# Altium schematic sheet [03] - CONNECTORS.SchDoc
size A4
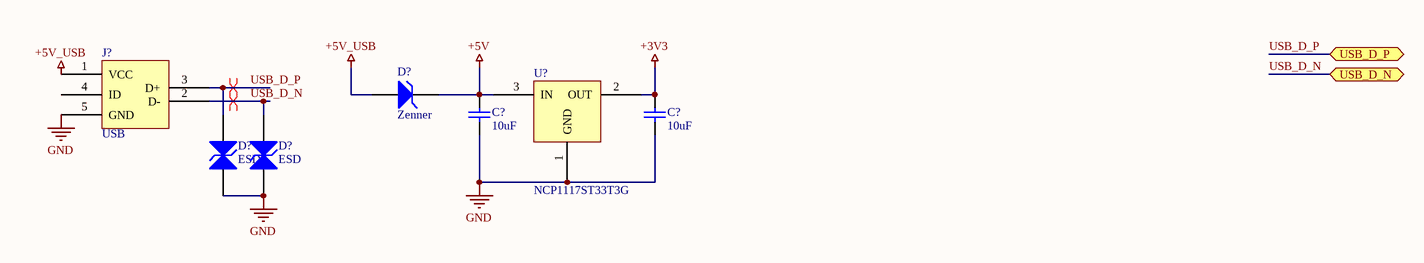
[diagram p0: [03] - CONNECTORS.SchDoc]

## Parts
(Parts that share a designator on the sheet are numbered #1, #2 ... from top to bottom, then left to right.)
C?#1  10uF
C?#2  10uF
D?#1  Zenner
D?#2  ESD
D?#3  ESD
J?  USB  [10118194-0001LF]
U?  NCP1117ST33T3G

## Ports
USB_D_N (bidir), USB_D_P (bidir)

## Nets
+3V3: C?#2.2 U?.2(OUT)
+5V: C?#1.2 D?#1.2(K) U?.3(IN)
+5V_USB: D?#1.1(A) J?.1(VCC)
GND: C?#1.1 C?#2.1 D?#2.1(A) D?#3.1(A) J?.5(GND) U?.1(GND)
USB_D_N: D?#3.2(K) J?.2(D-) ; port USB_D_N
USB_D_P: D?#2.2(K) J?.3(D+) ; port USB_D_P

Not connected (* = marked no-connect by the designer): J? 4(ID)

## Layout directives
differential pair; differential pair class USB_D_N: USB_D_N
differential pair; differential pair class USB_D_P: USB_D_P

## Library data of the parts
C?#1 C?#2 = CL21A106KPFNNNG: Cap Ceramic 10uF 10V X5R 10% SMD 0805 85C Embossed T/R; Manufacturer: Samsung; Supplier 1: Digi-Key; Manufacturer Part Number: CL21A106KPFNNNG; RoHS: Yes; Stock 1: 918320; Pricing 1: 1 = 0,14000, 10 = 0,10000, 100 = 0,04690, 500 = 0,03290, 1000 = 0,02724 (USD); Mount: Surface Mount; Case/Package: 0805; Case Code (Metric): 2012; Case Code (Imperial): 0805; Min Operating Temperature: -55°C; Max Operating Temperature: 85°C; Capacitance: 10uF; Tolerance: 10%; Dielectric: X5R; Voltage: 10V; Voltage Rating: 10V; Packaging: Tape and Reel; Package Quantity: 3000; Termination: Wraparound; Length: 2mm; Height: 1.25mm; Depth: 1.25mm; Width: 0.049inch; Thickness: 0.053inch; Radiation Hardening: No; Lead Free: Lead Free; ComponentLink1URL: https://datasheet.ciiva.com/16428/cl21a106kpfnnng-16428896.pdf?src-supplier=Future+Electronics; ComponentLink1Description: https://datasheet.ciiva.com/16428/cl21a106kpfnnng-16428896.pdf?src-supplier=Future+Electronics; ComponentLink2URL: https://datasheet.ciiva.com/26936/getdatasheetpartid-640497-26936900.pdf?src-supplier=Verical; ComponentLink2Description: https://datasheet.ciiva.com/26936/getdatasheetpartid-640497-26936900.pdf?src-supplier=Verical; Supplier Part Number 1: 1276-6456-1-ND
D?#1 = SS14: DIODE SCHOTTKY 40V 1A SMA; Manufacturer: ON Semiconductor / Fairchild; Forward Voltage: 500mV; Peak Non-Repetitive Surge Current: 40A; Element Configuration: Single; Peak Reverse Current: 200uA; Number of Elements: 1; Max Power Dissipation: 1.1W; Polarity: Standard; Supplier 1: Digi-Key; Manufacturer Part Number: SS14; RoHS: Yes; Stock 1: 183262; Pricing 1: 1 = 0,43000, 10 = 0,32500, 100 = 0,20270, 500 = 0,13872, 1000 = 0,10670 (USD); Mount: Surface Mount; Case/Package: SMA; Number of Pins: 2; Weight: 0.003739oz; Number of Terminals: 2; Min Operating Temperature: -65°C; Max Operating Temperature: 125°C; Packaging: Tape and Reel; Package Quantity: 7500; Forward Current: 1A; Max Repetitive Reverse Voltage (Vrrm): 40V; Max Forward Surge Current (Ifsm): 40A; Average Rectified Current: 1A; Termination: SMD/SMT; Power Dissipation: 1.1W; Voltage Rating (DC): 40V; Current Rating: 1A; Output Current: 1A; Current: 1A; Voltage: 40V; Max Reverse Voltage (DC): 40V; Length: 4.75mm; Height: 2.2mm; Width: 2.95mm; Radiation Hardening: No; REACH SVHC: No SVHC; Lead Free: Lead Free; ComponentLink1URL: https://datasheet.ciiva.com/34301/1089027-34301973.pdf?src-supplier=Jameco; ComponentLink1Description: https://datasheet.ciiva.com/34301/1089027-34301973.pdf?src-supplier=Jameco; ComponentLink2URL: https://datasheet.ciiva.com/4713/ss14-197224-4713938.pdf?src-supplier=Mouser; ComponentLink2Description: https://datasheet.ciiva.com/4713/ss14-197224-4713938.pdf?src-supplier=Mouser; ComponentLink3URL: https://datasheet.ciiva.com/16744/ss14-16744879.pdf?src-supplier=Future+Electronics; ComponentLink3Description: https://datasheet.ciiva.com/16744/ss14-16744879.pdf?src-supplier=Future+Electronics; ComponentLink4URL: https://datasheet.ciiva.com/8303/ss19-8303766.pdf?src-supplier=Avnet; ComponentLink4Description: https://datasheet.ciiva.com/8303/ss19-8303766.pdf?src-supplier=Avnet; ComponentLink5URL: https://datasheet.ciiva.com/910/ss12-910695.pdf?src-supplier=Digi-Key; ComponentLink5Description: https://datasheet.ciiva.com/910/ss12-910695.pdf?src-supplier=Digi-Key; ComponentLink6URL: https://datasheet.ciiva.com/7965/1766303-7965241.pdf?src-supplier=Element14; ComponentLink6Description: https://datasheet.ciiva.com/7965/1766303-7965241.pdf?src-supplier=Element14; ComponentLink7URL: https://datasheet.ciiva.com/910/ss12-910696.pdf?src-supplier=Digi-Key; ComponentLink7Description: https://datasheet.ciiva.com/910/ss12-910696.pdf?src-supplier=Digi-Key; ComponentLink8URL: https://datasheet.ciiva.com/25951/ss19-25951496.pdf?src-supplier=Avnet+Europe; ComponentLink8Description: https://datasheet.ciiva.com/25951/ss19-25951496.pdf?src-supplier=Avnet+Europe; ComponentLink9URL: https://datasheet.ciiva.com/910/ss12-910697.pdf?src-supplier=Digi-Key; ComponentLink9Description: https://datasheet.ciiva.com/910/ss12-910697.pdf?src-supplier=Digi-Key; ComponentLink10URL: https://datasheet.ciiva.com/22651/1880990-22651980.pdf?src-supplier=Element14; ComponentLink10Description: https://datasheet.ciiva.com/22651/1880990-22651980.pdf?src-supplier=Element14; Supplier Part Number 1: SS14CT-ND
D?#2 D?#3 = CPDQ5V0-HF: TVS DIODE 5V 18.6V 0402/SOD923F; Manufacturer: Comchip; Min Breakdown Voltage: 5.6V; Peak Pulse Power: 174W; Power Line Protection: No; Peak Pulse Current: 9.4A; Capacitance: 15pF; Number of Bidirectional Channels: 1; Supplier 1: Digi-Key; Manufacturer Part Number: CPDQ5V0-HF; RoHS: Yes; Stock 1: 208826; Pricing 1: 1 = 0,30000, 10 = 0,27600, 25 = 0,19840, 100 = 0,15440, 250 = 0,09704, 500 = 0,08268, 1000 = 0,05623, 2500 = 0,05072 (USD); Mount: Surface Mount; Case/Package: 0402; Min Operating Temperature: -40°C; Max Operating Temperature: 125°C; Packaging: Tape and Reel; Package Quantity: 8000; Reverse Standoff Voltage: 5V; Clamping Voltage: 18.6V; Breakdown Voltage: 5.6V; Composition: Zener; Operating Supply Voltage: 5V; ComponentLink1URL: https://datasheet.ciiva.com/6577/cpdq5v0-hf20reva825126-6577872.pdf?src-supplier=Digi-Key; ComponentLink1Description: https://datasheet.ciiva.com/6577/cpdq5v0-hf20reva825126-6577872.pdf?src-supplier=Digi-Key; ComponentLink2URL: https://datasheet.ciiva.com/12545/cpdq5v0-hf20reva825126-218795-12545530.pdf?src-supplier=Mouser; ComponentLink2Description: https://datasheet.ciiva.com/12545/cpdq5v0-hf20reva825126-218795-12545530.pdf?src-supplier=Mouser; Supplier Part Number 1: 641-1478-1-ND
J? = 10118194-0001LF: CONN RCPT USB2.0 MICRO B SMD R/A; Manufacturer: Amphenol FCI; Gender: Receptacle; Current Rating: 1.8A; Number of Contacts: 5; Insulation Resistance: 1GR; Number of Ports: 1; Max Voltage Rating (AC): 100V; Pitch: 0.65mm; Supplier 1: Digi-Key; Manufacturer Part Number: 10118194-0001LF; RoHS: Yes; Stock 1: 136800; Pricing 1: 1200 = 0,208430, 2400 = 0,190560, 6000 = 0,178650, 8400 = 0,166740, 12000 = 0,160790, 30000 = 0,158400, 60000 = 0,154830 (USD); Mount: Surface Mount; Color: Black; Contact Material: Copper Alloy; Contact Plating: Gold; Number of Terminals: 5; Housing Material: Polymer; Min Operating Temperature: -55°C; Max Operating Temperature: 85°C; Package Quantity: 9600; Packaging: Tape and Reel; Connector Type: USB; Termination: Solder; Orientation: Right Angle; Features: Shielded; Length: 8.05mm; Depth: 5mm; Radiation Hardening: No; Lead Free: Lead Free; Flammability Rating: UL94 V-0; ComponentLink1URL: https://datasheet.ciiva.com/4598/10118194ac-197217-4598807.pdf?src-supplier=Mouser; ComponentLink1Description: https://datasheet.ciiva.com/4598/10118194ac-197217-4598807.pdf?src-supplier=Mouser; ComponentLink2URL: https://datasheet.ciiva.com/29907/10118194-29907230.pdf?src-supplier=Avnet; ComponentLink2Description: https://datasheet.ciiva.com/29907/10118194-29907230.pdf?src-supplier=Avnet; ComponentLink3URL: https://datasheet.ciiva.com/26945/getdatasheetpartid-418619-26945695.pdf?src-supplier=Verical; ComponentLink3Description: https://datasheet.ciiva.com/26945/getdatasheetpartid-418619-26945695.pdf?src-supplier=Verical; ComponentLink4URL: https://datasheet.ciiva.com/851/10118194-851110.pdf?src-supplier=Digi-Key; ComponentLink4Description: https://datasheet.ciiva.com/851/10118194-851110.pdf?src-supplier=Digi-Key; ComponentLink5URL: https://datasheet.ciiva.com/851/10118194-851111.pdf?src-supplier=Digi-Key; ComponentLink5Description: https://datasheet.ciiva.com/851/10118194-851111.pdf?src-supplier=Digi-Key; Supplier Part Number 1: 609-4618-2-ND
U? = NCP1117ST33T3G: IC REG LINEAR 3.3V 1A SOT223; Manufacturer: ON Semiconductor; Max Input Voltage: 20V; Number of Outputs: 1; Dropout Voltage: 1.07V; Max Supply Voltage: 15V; Min Supply Voltage: 4.75V; Min Input Voltage: 3.5V; Input Bias Current: 6mA; Quiescent Current: 10mA; Polarity: Positive; Reference Voltage: 1.25V; Accuracy: 1%; Output Type: Fixed; Supplier 1: Digi-Key; Manufacturer Part Number: NCP1117ST33T3G; RoHS: Yes; Stock 1: 114545; Pricing 1: 1 = 0,52000, 10 = 0,44400, 100 = 0,33150, 500 = 0,26048, 1000 = 0,20129 (USD); Mount: Surface Mount; Case/Package: SOT-223; Number of Pins: 3; Contact Plating: Tin; Min Operating Temperature: 0°C; Max Operating Temperature: 125°C; Output Voltage: 3.3V; Packaging: Tape and Reel; Output Current: 1A; Max Output Current: 1A; Package Quantity: 1; Nominal Output Voltage: 3.3V; Number of Regulators: 1; Min Current Limit: 1A; Min Output Voltage: 3.3V; Max Output Voltage: 3.3V; Termination: SMD/SMT; Output Voltage Accuracy: 1%; Length: 6.7mm; Height: 1.69mm; Width: 3.7mm; Radiation Hardening: No; REACH SVHC: No SVHC; Lead Free: Lead Free; Halogen Free: Halogen Free; ComponentLink1URL: https://datasheet.ciiva.com/3224/ncp1117-d-3224144.pdf?src-supplier=Avnet; ComponentLink1Description: https://datasheet.ciiva.com/3224/ncp1117-d-3224144.pdf?src-supplier=Avnet; ComponentLink2URL: https://datasheet.ciiva.com/22697/1726422-22697602.pdf?src-supplier=Element14; ComponentLink2Description: https://datasheet.ciiva.com/22697/1726422-22697602.pdf?src-supplier=Element14; ComponentLink3URL: https://datasheet.ciiva.com/15111/getdatasheetpartid-82718-15111483.pdf?src-supplier=Verical; ComponentLink3Description: https://datasheet.ciiva.com/15111/getdatasheetpartid-82718-15111483.pdf?src-supplier=Verical; ComponentLink4URL: https://datasheet.ciiva.com/28483/1748260-28483307.pdf?src-supplier=Element14; ComponentLink4Description: https://datasheet.ciiva.com/28483/1748260-28483307.pdf?src-supplier=Element14; ComponentLink5URL: https://datasheet.ciiva.com/2042/ncp1117-d-2042028.pdf?src-supplier=Digi-Key; ComponentLink5Description: https://datasheet.ciiva.com/2042/ncp1117-d-2042028.pdf?src-supplier=Digi-Key; ComponentLink6URL: https://datasheet.ciiva.com/8233/ncp1117-d-8233589.pdf?src-supplier=Avnet; ComponentLink6Description: https://datasheet.ciiva.com/8233/ncp1117-d-8233589.pdf?src-supplier=Avnet; ComponentLink7URL: https://datasheet.ciiva.com/8073/1726422-8073735.pdf?src-supplier=Element14; ComponentLink7Description: https://datasheet.ciiva.com/8073/1726422-8073735.pdf?src-supplier=Element14; ComponentLink8URL: https://datasheet.ciiva.com/2042/ncp1117-d-2042027.pdf?src-supplier=Digi-Key; ComponentLink8Description: https://datasheet.ciiva.com/2042/ncp1117-d-2042027.pdf?src-supplier=Digi-Key; ComponentLink9URL: https://datasheet.ciiva.com/16382/ncp1117-d-16382636.pdf?src-supplier=Future+Electronics; ComponentLink9Description: https://datasheet.ciiva.com/16382/ncp1117-d-16382636.pdf?src-supplier=Future+Electronics; ComponentLink10URL: https://datasheet.ciiva.com/2042/ncp1117-d-2042029.pdf?src-supplier=Digi-Key; ComponentLink10Description: https://datasheet.ciiva.com/2042/ncp1117-d-2042029.pdf?src-supplier=Digi-Key; Supplier Part Number 1: NCP1117ST33T3GOSCT-ND